# Altium project AUX_POWER_V2.PrjPCB
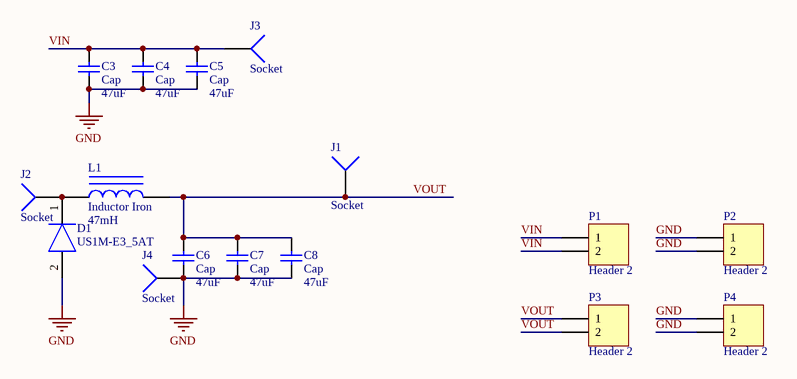
[diagram p0: AUX_POWER_V2.SchDoc]
1 sheet, 16 parts. Net scope: global (net labels, ports and power ports of the same name join across sheets).
Board file: AUX_POWER_V2.PcbDoc

## Sheet AUX_POWER_V2.SchDoc
size A4

### Parts
C3  Cap  value 47uF  [C1210]
C4  Cap  value 47uF  [C1210]
C5  Cap  value 47uF  [C1210]
C6  Cap  value 47uF  [C1210]
C7  Cap  value 47uF  [C1210]
C8  Cap  value 47uF  [C1210]
D1  US1M-E3_5AT  [DIOM5127X229N]
J1  Socket  [PIN1]
J2  Socket  [PIN1]
J3  Socket  [PIN1]
J4  Socket  [PIN1]
L1  Inductor Iron  value 47mH  [CDRH127]
P1  Header 2  [HDR1X2]
P2  Header 2  [HDR1X2]
P3  Header 2  [HDR1X2]
P4  Header 2  [HDR1X2]

### Nets
GND: C3.1 C4.1 C5.1 C6.1 C7.1 C8.1 D1.2(A) J4.1 P2.1 P2.2 P4.1 P4.2
VIN: C3.2 C4.2 C5.2 J3.1 P1.1 P1.2
VOUT: C6.2 C7.2 C8.2 J1.1 L1.2 P3.1 P3.2
NetD1_1: D1.1(K) J2.1 L1.1

### Library data of the parts
C3-C8 = Cap: Capacitor; Published: 8-Jun-2000; LatestRevisionDate: 17-Jul-2002; LatestRevisionNote: Re-released for DXP Platform.; PackageReference: RAD-0.3; Publisher: Altium Limited; PackageDescription: Radial Cap, Thru-Hole; 2 Leads; 0.3 in Pin Spacing
D1 = US1M-E3_5AT: Diode; Manufacturer_Name: Vishay; Manufacturer_Part_Number: US1M-E3/5AT; Allied_Number: R1082668; Datasheet Link: https://www.vishay.com/docs/88768/us1.pdf; Height: 2.29mm; Mouser Part Number: 625-US1M-E3/5AT; Mouser Price/Stock: https://www.mouser.com/Search/Refine.aspx?Keyword=625-US1M-E3%2F5AT; RS Part Number: 9190755; RS Price/Stock: http://uk.rs-online.com/web/p/products/9190755; Allied Price/Stock: https://www.alliedelec.com/vishaydale-us1m-e3-5at/R1082668/
L1 = Inductor Iron: Magnetic-Core Inductor; Published: 24-Mar-1999; LatestRevisionDate: 17-Jul-2002; LatestRevisionNote: Re-released for DXP Platform.; PackageReference: AXIAL-0.9; Publisher: Altium Limited; PackageDescription: Axial Device, Thru-Hole; 2 Leads; 0.9 in Pin Spacing
P1-P4 = Header 2: Header, 2-Pin; LatestRevisionDate: 17-Jul-2002; LatestRevisionNote: Re-released for DXP Platform.; Publisher: Altium Limited
J1-J4 = Socket: LatestRevisionDate: 17-Jul-2002; LatestRevisionNote: Re-released for DXP Platform.; Publisher: Altium Limited